# Altium schematic sheet SDRAM.SchDoc
size 297 x 420 mm; CmpIndex: 72; SymIndex: 41
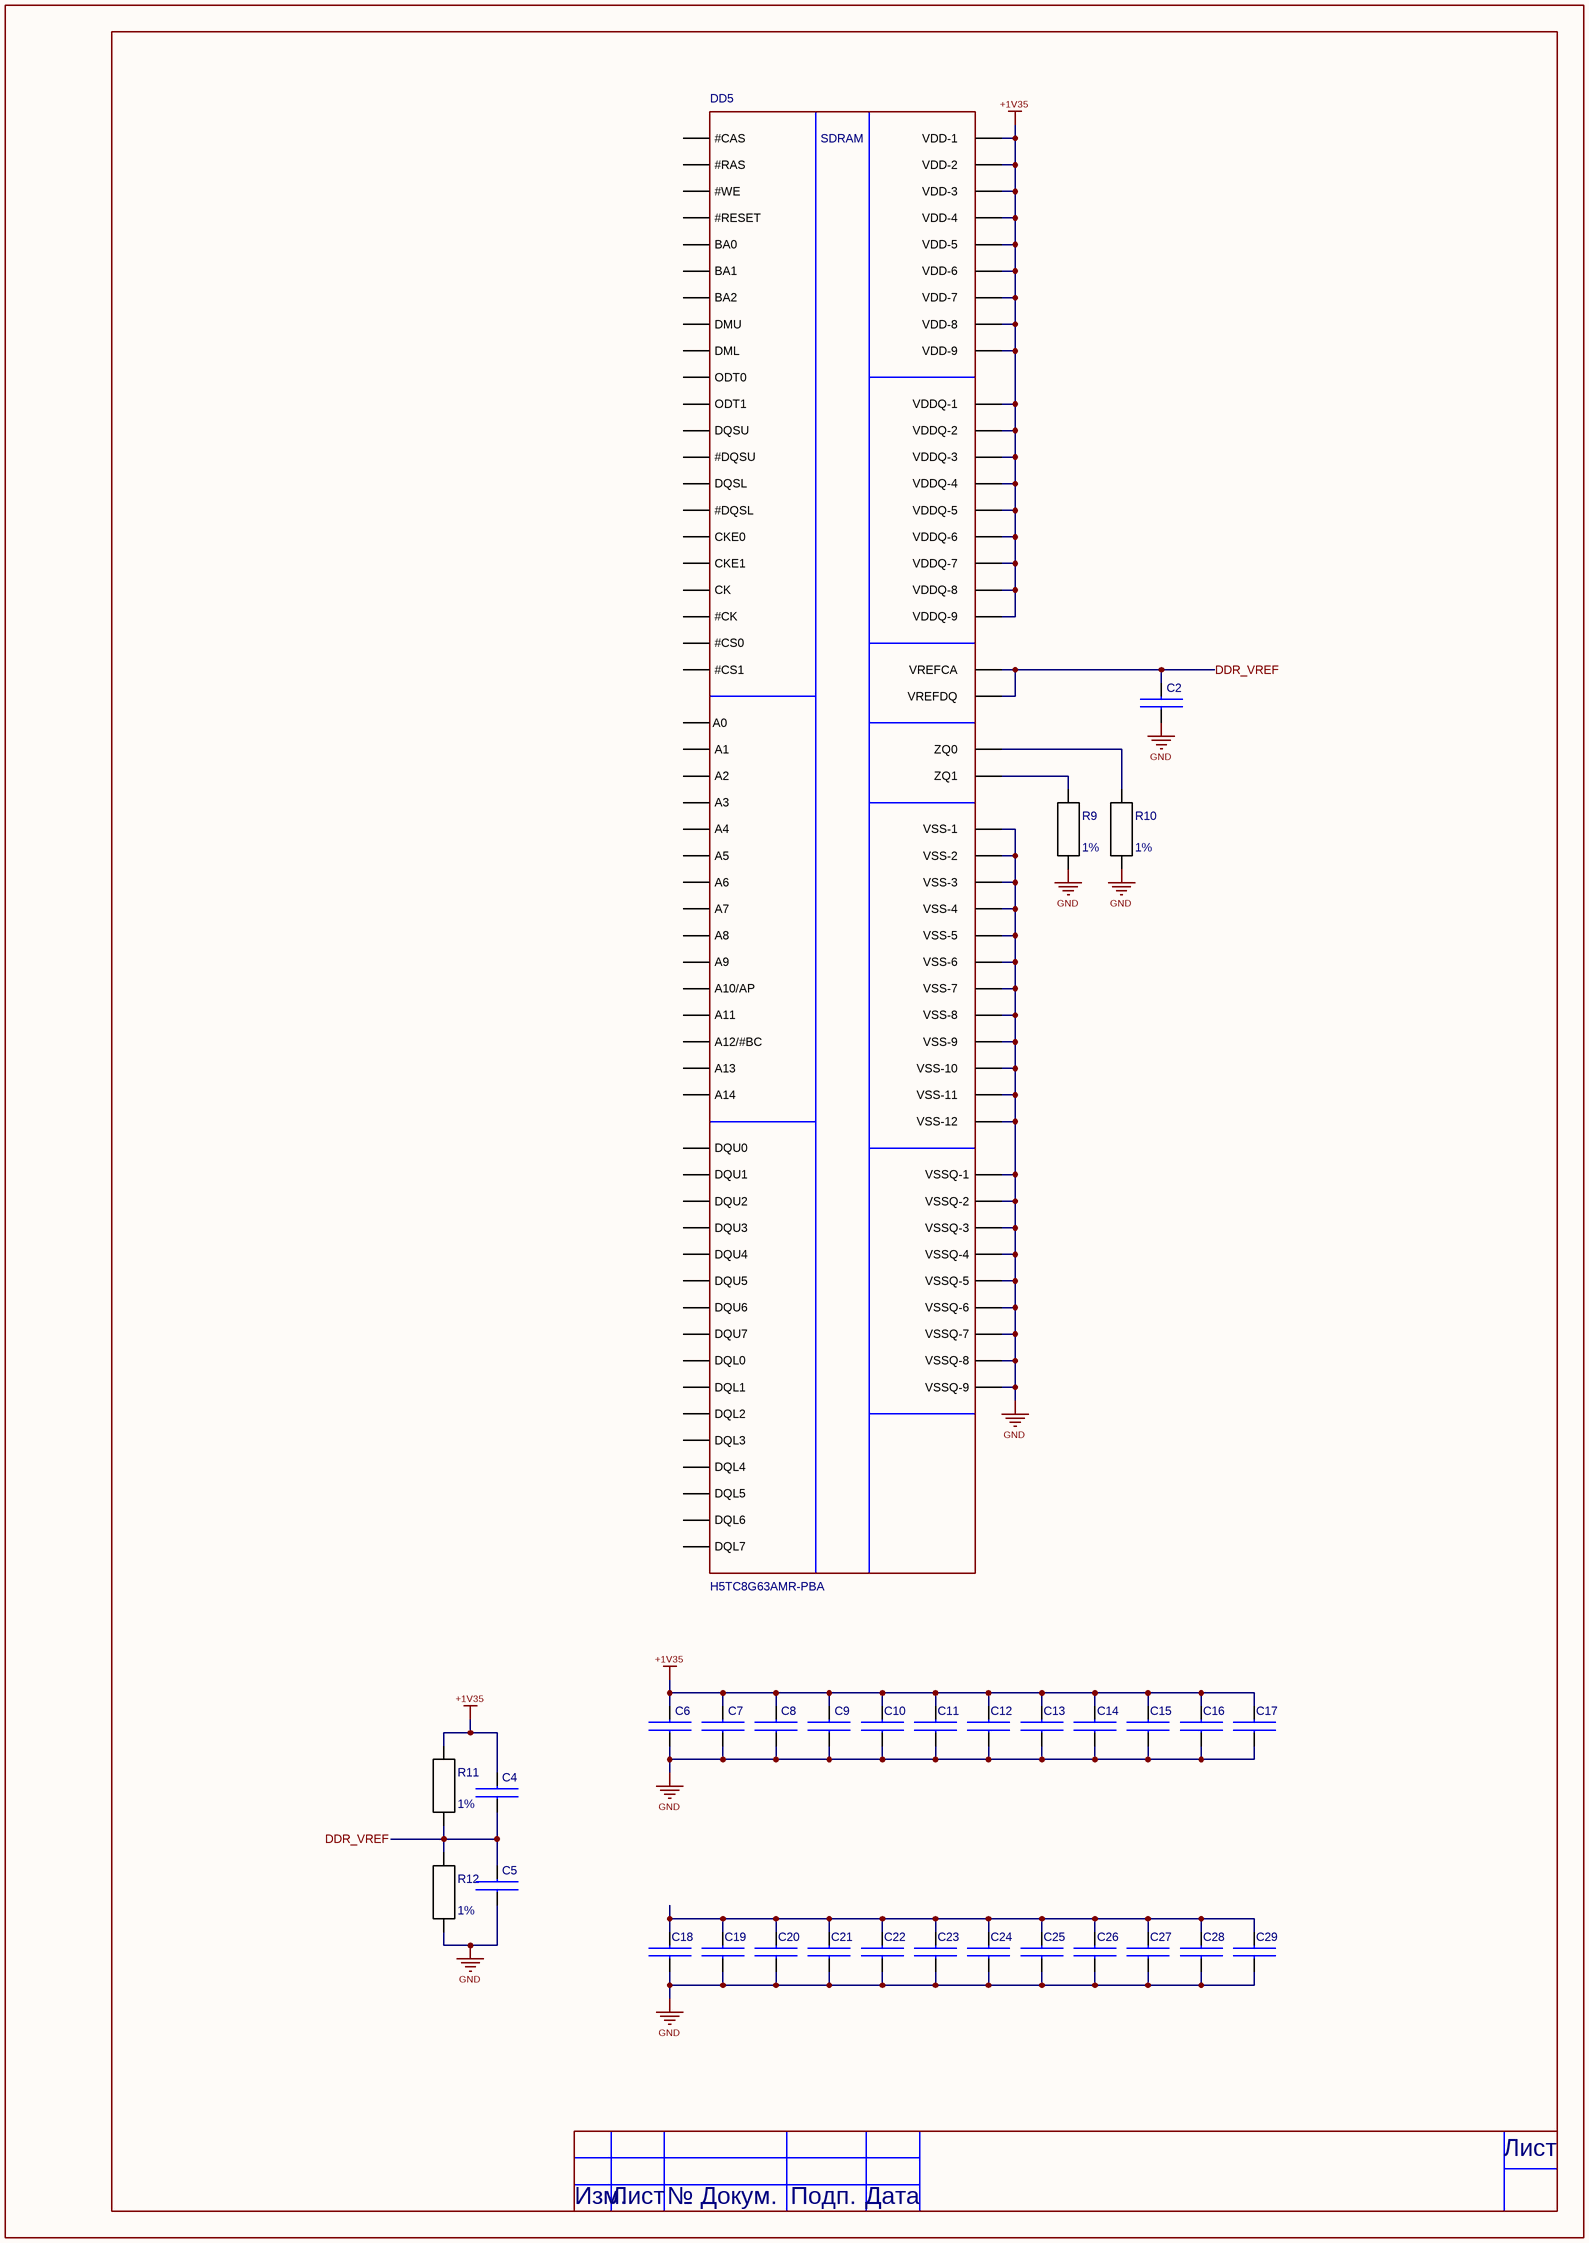
[diagram p0: SDRAM.SchDoc]

## Parts
C2  0402-0.1uF-50V-10%-X7R  (value not drawn)
C4  0402-0.1uF-50V-10%-X7R  (value not drawn)
C5  0402-0.1uF-50V-10%-X7R  (value not drawn)
C6  0402-0.1uF-50V-10%-X7R  (value not drawn)
C7  0402-0.1uF-50V-10%-X7R  (value not drawn)
C8  0402-0.1uF-50V-10%-X7R  (value not drawn)
C9  0402-0.1uF-50V-10%-X7R  (value not drawn)
C10  0402-0.1uF-50V-10%-X7R  (value not drawn)
C11  0402-0.1uF-50V-10%-X7R  (value not drawn)
C12  0402-0.1uF-50V-10%-X7R  (value not drawn)
C13  0402-0.1uF-50V-10%-X7R  (value not drawn)
C14  0402-0.1uF-50V-10%-X7R  (value not drawn)
C15  0402-0.1uF-50V-10%-X7R  (value not drawn)
C16  0402-0.1uF-50V-10%-X7R  (value not drawn)
C17  0402-0.1uF-50V-10%-X7R  (value not drawn)
C18  0402-0.1uF-50V-10%-X7R  (value not drawn)
C19  0402-0.1uF-50V-10%-X7R  (value not drawn)
C20  0402-0.1uF-50V-10%-X7R  (value not drawn)
C21  0402-0.1uF-50V-10%-X7R  (value not drawn)
C22  0402-0.1uF-50V-10%-X7R  (value not drawn)
C23  0402-0.1uF-50V-10%-X7R  (value not drawn)
C24  0402-0.1uF-50V-10%-X7R  (value not drawn)
C25  0402-0.1uF-50V-10%-X7R  (value not drawn)
C26  0402-0.1uF-50V-10%-X7R  (value not drawn)
C27  0402-0.1uF-50V-10%-X7R  (value not drawn)
C28  0402-0.1uF-50V-10%-X7R  (value not drawn)
C29  0402-0.1uF-50V-10%-X7R  (value not drawn)
DD5  H5TC8G63AMR-PBA
R9  Tolerance: 1%  (hidden comment: 0402-243R-1%-1/16 W-100ppm)
R10  Tolerance: 1%  (hidden comment: 0402-243R-1%-1/16 W-100ppm)
R11  Tolerance: 1%  (hidden comment: 0402-2k-1%-1/16 W-100ppm)
R12  Tolerance: 1%  (hidden comment: 0402-2k-1%-1/16 W-100ppm)

## Nets
+1V35: C4.2 C6.2 C7.2 C8.2 C9.2 C10.2 C11.2 C12.2 C13.2 C14.2 C15.2 C16.2 C17.2 DD5.A1(VDDQ-1) DD5.A8(VDDQ-6) DD5.B2(VDD-3) DD5.C1(VDDQ-2) DD5.C9(VDDQ-7) DD5.D2(VDDQ-4) DD5.D9(VDD-7) DD5.E9(VDDQ-8) DD5.F1(VDDQ-3) DD5.G7(VDD-5) DD5.H2(VDDQ-5) DD5.H9(VDDQ-9) DD5.K2(VDD-4) DD5.K8(VDD-6) DD5.N1(VDD-1) DD5.N9(VDD-8) DD5.R1(VDD-2) DD5.R9(VDD-9) R11.2
GND: C2.1 C5.1 C6.1 C7.1 C8.1 C9.1 C10.1 C11.1 C12.1 C13.1 C14.1 C15.1 C16.1 C17.1 C18.1 C19.1 C20.1 C21.1 C22.1 C23.1 C24.1 C25.1 C26.1 C27.1 C28.1 C29.1 DD5.A9(VSS-9) DD5.B1(VSSQ-1) DD5.B3(VSS-6) DD5.B9(VSSQ-7) DD5.D1(VSSQ-2) DD5.D8(VSSQ-5) DD5.E1(VSS-1) DD5.E2(VSSQ-4) DD5.E8(VSSQ-6) DD5.F9(VSSQ-8) DD5.G1(VSSQ-3) DD5.G8(VSS-7) DD5.G9(VSSQ-9) DD5.J2(VSS-5) DD5.J8(VSS-8) DD5.M1(VSS-2) DD5.M9(VSS-10) DD5.P1(VSS-3) DD5.P9(VSS-11) DD5.T1(VSS-4) DD5.T9(VSS-12) R9.2 R10.2 R12.1
DDR_VREF: C2.2 C4.1 C5.2 DD5.H1(VREFDQ) DD5.M8(VREFCA) R11.1 R12.2
NetC18_2: C18.2 C19.2 C20.2 C21.2 C22.2 C23.2 C24.2 C25.2 C26.2 C27.2 C28.2 C29.2
NetDD5_L8: DD5.L8(ZQ0) R10.1
NetDD5_L9: DD5.L9(ZQ1) R9.1

Not connected (* = marked no-connect by the designer): DD5 A2(DQU5) A3(DQU7) A7(DQU4) B7(#DQSU) B8(DQU6) C2(DQU3) C3(DQU1) C7(DQSU) C8(DQU2) D3(DMU) D7(DQU0) E3(DQL0) E7(DML) F2(DQL2) F3(DQSL) F7(DQL1) F8(DQL3) G2(DQL6) G3(#DQSL) H3(DQL4) H7(DQL7) H8(DQL5) J1(ODT1) J3(#RAS) J7(CK) J9(CKE1) K1(ODT0) K3(#CAS) K7(#CK) K9(CKE0) L1(#CS1) L2(#CS0) L3(#WE) L7(A10/AP) M2(BA0) M3(BA2) N2(A3) N3(A0) N7(A12/#BC) N8(BA1) P2(A5) P3(A2) P7(A1) P8(A4) R2(A7) R3(A9) R7(A11) R8(A6) T2(#RESET) T3(A13) T7(A14) T8(A8)

## Notes on the sheet
- Лист
- Изм.
- № Докум.
- Подп.
- Дата
- (in symbol H5TC8G63AMR-PBA) SDRAM

## Library data of the parts
C2 = 0402-0.1uF-50V-10%-X7R: Cell Name: 0402_CAPC100X50X55L25N; CmpIndex: 25; DXDB_LIBNAME: Capacitors Ceramic SMD; Ref Designator: C2; Tolerance: 10%; Orientation: 7 = 7; Part Label: 0402-0.1uF-50V-10%-X7R; Part Name: 0402-0.1uF-50V-10%-X7R; Part Number NP: 0402-0.1uF-50V-10%-X7R; Part Number: 0402-0.1uF-50V-10%-X7R; SymIndex: 25
C4 = 0402-0.1uF-50V-10%-X7R: Cell Name: 0402_CAPC100X50X55L25N; CmpIndex: 34; DXDB_LIBNAME: Capacitors Ceramic SMD; Ref Designator: C4; SymIndex: 25; Tolerance: 10%; Orientation: 1 = 1; Part Label: 0402-0.1uF-50V-10%-X7R; Part Name: 0402-0.1uF-50V-10%-X7R; Part Number NP: 0402-0.1uF-50V-10%-X7R; Part Number: 0402-0.1uF-50V-10%-X7R
C5 = 0402-0.1uF-50V-10%-X7R: Cell Name: 0402_CAPC100X50X55L25N; CmpIndex: 35; DXDB_LIBNAME: Capacitors Ceramic SMD; Ref Designator: C5; SymIndex: 25; Tolerance: 10%; Orientation: 1 = 1; Part Label: 0402-0.1uF-50V-10%-X7R; Part Name: 0402-0.1uF-50V-10%-X7R; Part Number NP: 0402-0.1uF-50V-10%-X7R; Part Number: 0402-0.1uF-50V-10%-X7R
C6 = 0402-0.1uF-50V-10%-X7R: Cell Name: 0402_CAPC100X50X55L25N; CmpIndex: 43; DXDB_LIBNAME: Capacitors Ceramic SMD; Ref Designator: C6; SymIndex: 25; Tolerance: 10%; Orientation: 1 = 1; Part Label: 0402-0.1uF-50V-10%-X7R; Part Name: 0402-0.1uF-50V-10%-X7R; Part Number NP: 0402-0.1uF-50V-10%-X7R; Part Number: 0402-0.1uF-50V-10%-X7R
C7 = 0402-0.1uF-50V-10%-X7R: Cell Name: 0402_CAPC100X50X55L25N; CmpIndex: 46; DXDB_LIBNAME: Capacitors Ceramic SMD; Ref Designator: C7; SymIndex: 25; Tolerance: 10%; Orientation: 1 = 1; Part Label: 0402-0.1uF-50V-10%-X7R; Part Name: 0402-0.1uF-50V-10%-X7R; Part Number NP: 0402-0.1uF-50V-10%-X7R; Part Number: 0402-0.1uF-50V-10%-X7R
C8 = 0402-0.1uF-50V-10%-X7R: Cell Name: 0402_CAPC100X50X55L25N; CmpIndex: 47; DXDB_LIBNAME: Capacitors Ceramic SMD; Ref Designator: C8; SymIndex: 25; Tolerance: 10%; Orientation: 1 = 1; Part Label: 0402-0.1uF-50V-10%-X7R; Part Name: 0402-0.1uF-50V-10%-X7R; Part Number NP: 0402-0.1uF-50V-10%-X7R; Part Number: 0402-0.1uF-50V-10%-X7R
C9 = 0402-0.1uF-50V-10%-X7R: Cell Name: 0402_CAPC100X50X55L25N; CmpIndex: 48; DXDB_LIBNAME: Capacitors Ceramic SMD; Ref Designator: C9; SymIndex: 25; Tolerance: 10%; Orientation: 1 = 1; Part Label: 0402-0.1uF-50V-10%-X7R; Part Name: 0402-0.1uF-50V-10%-X7R; Part Number NP: 0402-0.1uF-50V-10%-X7R; Part Number: 0402-0.1uF-50V-10%-X7R
C10 = 0402-0.1uF-50V-10%-X7R: Cell Name: 0402_CAPC100X50X55L25N; CmpIndex: 49; DXDB_LIBNAME: Capacitors Ceramic SMD; Ref Designator: C10; SymIndex: 25; Tolerance: 10%; Orientation: 1 = 1; Part Label: 0402-0.1uF-50V-10%-X7R; Part Name: 0402-0.1uF-50V-10%-X7R; Part Number NP: 0402-0.1uF-50V-10%-X7R; Part Number: 0402-0.1uF-50V-10%-X7R
C11 = 0402-0.1uF-50V-10%-X7R: Cell Name: 0402_CAPC100X50X55L25N; CmpIndex: 50; DXDB_LIBNAME: Capacitors Ceramic SMD; Ref Designator: C11; SymIndex: 25; Tolerance: 10%; Orientation: 1 = 1; Part Label: 0402-0.1uF-50V-10%-X7R; Part Name: 0402-0.1uF-50V-10%-X7R; Part Number NP: 0402-0.1uF-50V-10%-X7R; Part Number: 0402-0.1uF-50V-10%-X7R
C12 = 0402-0.1uF-50V-10%-X7R: Cell Name: 0402_CAPC100X50X55L25N; CmpIndex: 56; DXDB_LIBNAME: Capacitors Ceramic SMD; Ref Designator: C12; SymIndex: 25; Tolerance: 10%; Orientation: 1 = 1; Part Label: 0402-0.1uF-50V-10%-X7R; Part Name: 0402-0.1uF-50V-10%-X7R; Part Number NP: 0402-0.1uF-50V-10%-X7R; Part Number: 0402-0.1uF-50V-10%-X7R
C13 = 0402-0.1uF-50V-10%-X7R: Cell Name: 0402_CAPC100X50X55L25N; CmpIndex: 55; DXDB_LIBNAME: Capacitors Ceramic SMD; Ref Designator: C13; SymIndex: 25; Tolerance: 10%; Orientation: 1 = 1; Part Label: 0402-0.1uF-50V-10%-X7R; Part Name: 0402-0.1uF-50V-10%-X7R; Part Number NP: 0402-0.1uF-50V-10%-X7R; Part Number: 0402-0.1uF-50V-10%-X7R
C14 = 0402-0.1uF-50V-10%-X7R: Cell Name: 0402_CAPC100X50X55L25N; CmpIndex: 54; DXDB_LIBNAME: Capacitors Ceramic SMD; Ref Designator: C14; SymIndex: 25; Tolerance: 10%; Orientation: 1 = 1; Part Label: 0402-0.1uF-50V-10%-X7R; Part Name: 0402-0.1uF-50V-10%-X7R; Part Number NP: 0402-0.1uF-50V-10%-X7R; Part Number: 0402-0.1uF-50V-10%-X7R
C15 = 0402-0.1uF-50V-10%-X7R: Cell Name: 0402_CAPC100X50X55L25N; CmpIndex: 53; DXDB_LIBNAME: Capacitors Ceramic SMD; Ref Designator: C15; SymIndex: 25; Tolerance: 10%; Orientation: 1 = 1; Part Label: 0402-0.1uF-50V-10%-X7R; Part Name: 0402-0.1uF-50V-10%-X7R; Part Number NP: 0402-0.1uF-50V-10%-X7R; Part Number: 0402-0.1uF-50V-10%-X7R
C16 = 0402-0.1uF-50V-10%-X7R: Cell Name: 0402_CAPC100X50X55L25N; CmpIndex: 52; DXDB_LIBNAME: Capacitors Ceramic SMD; Ref Designator: C16; SymIndex: 25; Tolerance: 10%; Orientation: 1 = 1; Part Label: 0402-0.1uF-50V-10%-X7R; Part Name: 0402-0.1uF-50V-10%-X7R; Part Number NP: 0402-0.1uF-50V-10%-X7R; Part Number: 0402-0.1uF-50V-10%-X7R
C17 = 0402-0.1uF-50V-10%-X7R: Cell Name: 0402_CAPC100X50X55L25N; CmpIndex: 51; DXDB_LIBNAME: Capacitors Ceramic SMD; Ref Designator: C17; SymIndex: 25; Tolerance: 10%; Orientation: 1 = 1; Part Label: 0402-0.1uF-50V-10%-X7R; Part Name: 0402-0.1uF-50V-10%-X7R; Part Number NP: 0402-0.1uF-50V-10%-X7R; Part Number: 0402-0.1uF-50V-10%-X7R
C18 = 0402-0.1uF-50V-10%-X7R: Cell Name: 0402_CAPC100X50X55L25N; CmpIndex: 70; DXDB_LIBNAME: Capacitors Ceramic SMD; Ref Designator: C18; SymIndex: 25; Tolerance: 10%; Orientation: 1 = 1; Part Label: 0402-0.1uF-50V-10%-X7R; Part Name: 0402-0.1uF-50V-10%-X7R; Part Number NP: 0402-0.1uF-50V-10%-X7R; Part Number: 0402-0.1uF-50V-10%-X7R
C19 = 0402-0.1uF-50V-10%-X7R: Cell Name: 0402_CAPC100X50X55L25N; CmpIndex: 67; DXDB_LIBNAME: Capacitors Ceramic SMD; Ref Designator: C19; SymIndex: 25; Tolerance: 10%; Orientation: 1 = 1; Part Label: 0402-0.1uF-50V-10%-X7R; Part Name: 0402-0.1uF-50V-10%-X7R; Part Number NP: 0402-0.1uF-50V-10%-X7R; Part Number: 0402-0.1uF-50V-10%-X7R
C20 = 0402-0.1uF-50V-10%-X7R: Cell Name: 0402_CAPC100X50X55L25N; CmpIndex: 66; DXDB_LIBNAME: Capacitors Ceramic SMD; Ref Designator: C20; SymIndex: 25; Tolerance: 10%; Orientation: 1 = 1; Part Label: 0402-0.1uF-50V-10%-X7R; Part Name: 0402-0.1uF-50V-10%-X7R; Part Number NP: 0402-0.1uF-50V-10%-X7R; Part Number: 0402-0.1uF-50V-10%-X7R
C21 = 0402-0.1uF-50V-10%-X7R: Cell Name: 0402_CAPC100X50X55L25N; CmpIndex: 65; DXDB_LIBNAME: Capacitors Ceramic SMD; Ref Designator: C21; SymIndex: 25; Tolerance: 10%; Orientation: 1 = 1; Part Label: 0402-0.1uF-50V-10%-X7R; Part Name: 0402-0.1uF-50V-10%-X7R; Part Number NP: 0402-0.1uF-50V-10%-X7R; Part Number: 0402-0.1uF-50V-10%-X7R
C22 = 0402-0.1uF-50V-10%-X7R: Cell Name: 0402_CAPC100X50X55L25N; CmpIndex: 64; DXDB_LIBNAME: Capacitors Ceramic SMD; Ref Designator: C22; SymIndex: 25; Tolerance: 10%; Orientation: 1 = 1; Part Label: 0402-0.1uF-50V-10%-X7R; Part Name: 0402-0.1uF-50V-10%-X7R; Part Number NP: 0402-0.1uF-50V-10%-X7R; Part Number: 0402-0.1uF-50V-10%-X7R
C23 = 0402-0.1uF-50V-10%-X7R: Cell Name: 0402_CAPC100X50X55L25N; CmpIndex: 63; DXDB_LIBNAME: Capacitors Ceramic SMD; Ref Designator: C23; SymIndex: 25; Tolerance: 10%; Orientation: 1 = 1; Part Label: 0402-0.1uF-50V-10%-X7R; Part Name: 0402-0.1uF-50V-10%-X7R; Part Number NP: 0402-0.1uF-50V-10%-X7R; Part Number: 0402-0.1uF-50V-10%-X7R
C24 = 0402-0.1uF-50V-10%-X7R: Cell Name: 0402_CAPC100X50X55L25N; CmpIndex: 62; DXDB_LIBNAME: Capacitors Ceramic SMD; Ref Designator: C24; SymIndex: 25; Tolerance: 10%; Orientation: 1 = 1; Part Label: 0402-0.1uF-50V-10%-X7R; Part Name: 0402-0.1uF-50V-10%-X7R; Part Number NP: 0402-0.1uF-50V-10%-X7R; Part Number: 0402-0.1uF-50V-10%-X7R
C25 = 0402-0.1uF-50V-10%-X7R: Cell Name: 0402_CAPC100X50X55L25N; CmpIndex: 61; DXDB_LIBNAME: Capacitors Ceramic SMD; Ref Designator: C25; SymIndex: 25; Tolerance: 10%; Orientation: 1 = 1; Part Label: 0402-0.1uF-50V-10%-X7R; Part Name: 0402-0.1uF-50V-10%-X7R; Part Number NP: 0402-0.1uF-50V-10%-X7R; Part Number: 0402-0.1uF-50V-10%-X7R
C26 = 0402-0.1uF-50V-10%-X7R: Cell Name: 0402_CAPC100X50X55L25N; CmpIndex: 60; DXDB_LIBNAME: Capacitors Ceramic SMD; Ref Designator: C26; SymIndex: 25; Tolerance: 10%; Orientation: 1 = 1; Part Label: 0402-0.1uF-50V-10%-X7R; Part Name: 0402-0.1uF-50V-10%-X7R; Part Number NP: 0402-0.1uF-50V-10%-X7R; Part Number: 0402-0.1uF-50V-10%-X7R
C27 = 0402-0.1uF-50V-10%-X7R: Cell Name: 0402_CAPC100X50X55L25N; CmpIndex: 59; DXDB_LIBNAME: Capacitors Ceramic SMD; Ref Designator: C27; SymIndex: 25; Tolerance: 10%; Orientation: 1 = 1; Part Label: 0402-0.1uF-50V-10%-X7R; Part Name: 0402-0.1uF-50V-10%-X7R; Part Number NP: 0402-0.1uF-50V-10%-X7R; Part Number: 0402-0.1uF-50V-10%-X7R
C28 = 0402-0.1uF-50V-10%-X7R: Cell Name: 0402_CAPC100X50X55L25N; CmpIndex: 58; DXDB_LIBNAME: Capacitors Ceramic SMD; Ref Designator: C28; SymIndex: 25; Tolerance: 10%; Orientation: 1 = 1; Part Label: 0402-0.1uF-50V-10%-X7R; Part Name: 0402-0.1uF-50V-10%-X7R; Part Number NP: 0402-0.1uF-50V-10%-X7R; Part Number: 0402-0.1uF-50V-10%-X7R
C29 = 0402-0.1uF-50V-10%-X7R: Cell Name: 0402_CAPC100X50X55L25N; CmpIndex: 57; DXDB_LIBNAME: Capacitors Ceramic SMD; Ref Designator: C29; SymIndex: 25; Tolerance: 10%; Orientation: 1 = 1; Part Label: 0402-0.1uF-50V-10%-X7R; Part Name: 0402-0.1uF-50V-10%-X7R; Part Number NP: 0402-0.1uF-50V-10%-X7R; Part Number: 0402-0.1uF-50V-10%-X7R
DD5 = H5TC8G63AMR-PBA: CmpIndex: 1; DXDB_LIBNAME: Memory SDRAM; Ref Designator: DD5; SymIndex: 40; Orientation: 0 = 0; Part Label: H5TC8G63AMR-PBA; Part Name: H5TC8G63AMR-PBA; Part Number NP: H5TC8G63AMR-PBA; Part Number: H5TC8G63AMR-PBA
R9 = 0402-243R-1%-1/16 W-100ppm: Cell Name: 0402_RESC100X50X35L25N; CmpIndex: 23; DXDB_LIBNAME: Resistors Surface Mount; Ref Designator: R9; SymIndex: 13; Orientation: 5 = 5; Part Label: 0402-243R-1%-1/16 W-100ppm; Part Name: 0402-243R-1%-1/16 W-100ppm; Part Number NP: 0402-243R-1%-1/16 W-100ppm; Part Number: 0402-243R-1%-1/16 W-100ppm
R10 = 0402-243R-1%-1/16 W-100ppm: Cell Name: 0402_RESC100X50X35L25N; CmpIndex: 32; DXDB_LIBNAME: Resistors Surface Mount; Ref Designator: R10; SymIndex: 13; Orientation: 3 = 3; Part Label: 0402-243R-1%-1/16 W-100ppm; Part Name: 0402-243R-1%-1/16 W-100ppm; Part Number NP: 0402-243R-1%-1/16 W-100ppm; Part Number: 0402-243R-1%-1/16 W-100ppm
R11 = 0402-2k-1%-1/16 W-100ppm: Cell Name: 0402_RESC100X50X35L25N; CmpIndex: 36; DXDB_LIBNAME: Resistors Surface Mount; Ref Designator: R11; SymIndex: 13; Orientation: 1 = 1; Part Label: 0402-2k-1%-1/16 W-100ppm; Part Name: 0402-2k-1%-1/16 W-100ppm; Part Number NP: 0402-2k-1%-1/16 W-100ppm; Part Number: 0402-2k-1%-1/16 W-100ppm
R12 = 0402-2k-1%-1/16 W-100ppm: Cell Name: 0402_RESC100X50X35L25N; CmpIndex: 37; DXDB_LIBNAME: Resistors Surface Mount; Ref Designator: R12; SymIndex: 13; Orientation: 1 = 1; Part Label: 0402-2k-1%-1/16 W-100ppm; Part Name: 0402-2k-1%-1/16 W-100ppm; Part Number NP: 0402-2k-1%-1/16 W-100ppm; Part Number: 0402-2k-1%-1/16 W-100ppm